# EasyEDA schematic SCH_TempMate_2.json
TITLE: Sheet_1; REV: 1.0; Date: 2025-06-21; Sheet: 1/1; Drawn By: duleni_w; Company: Your Company
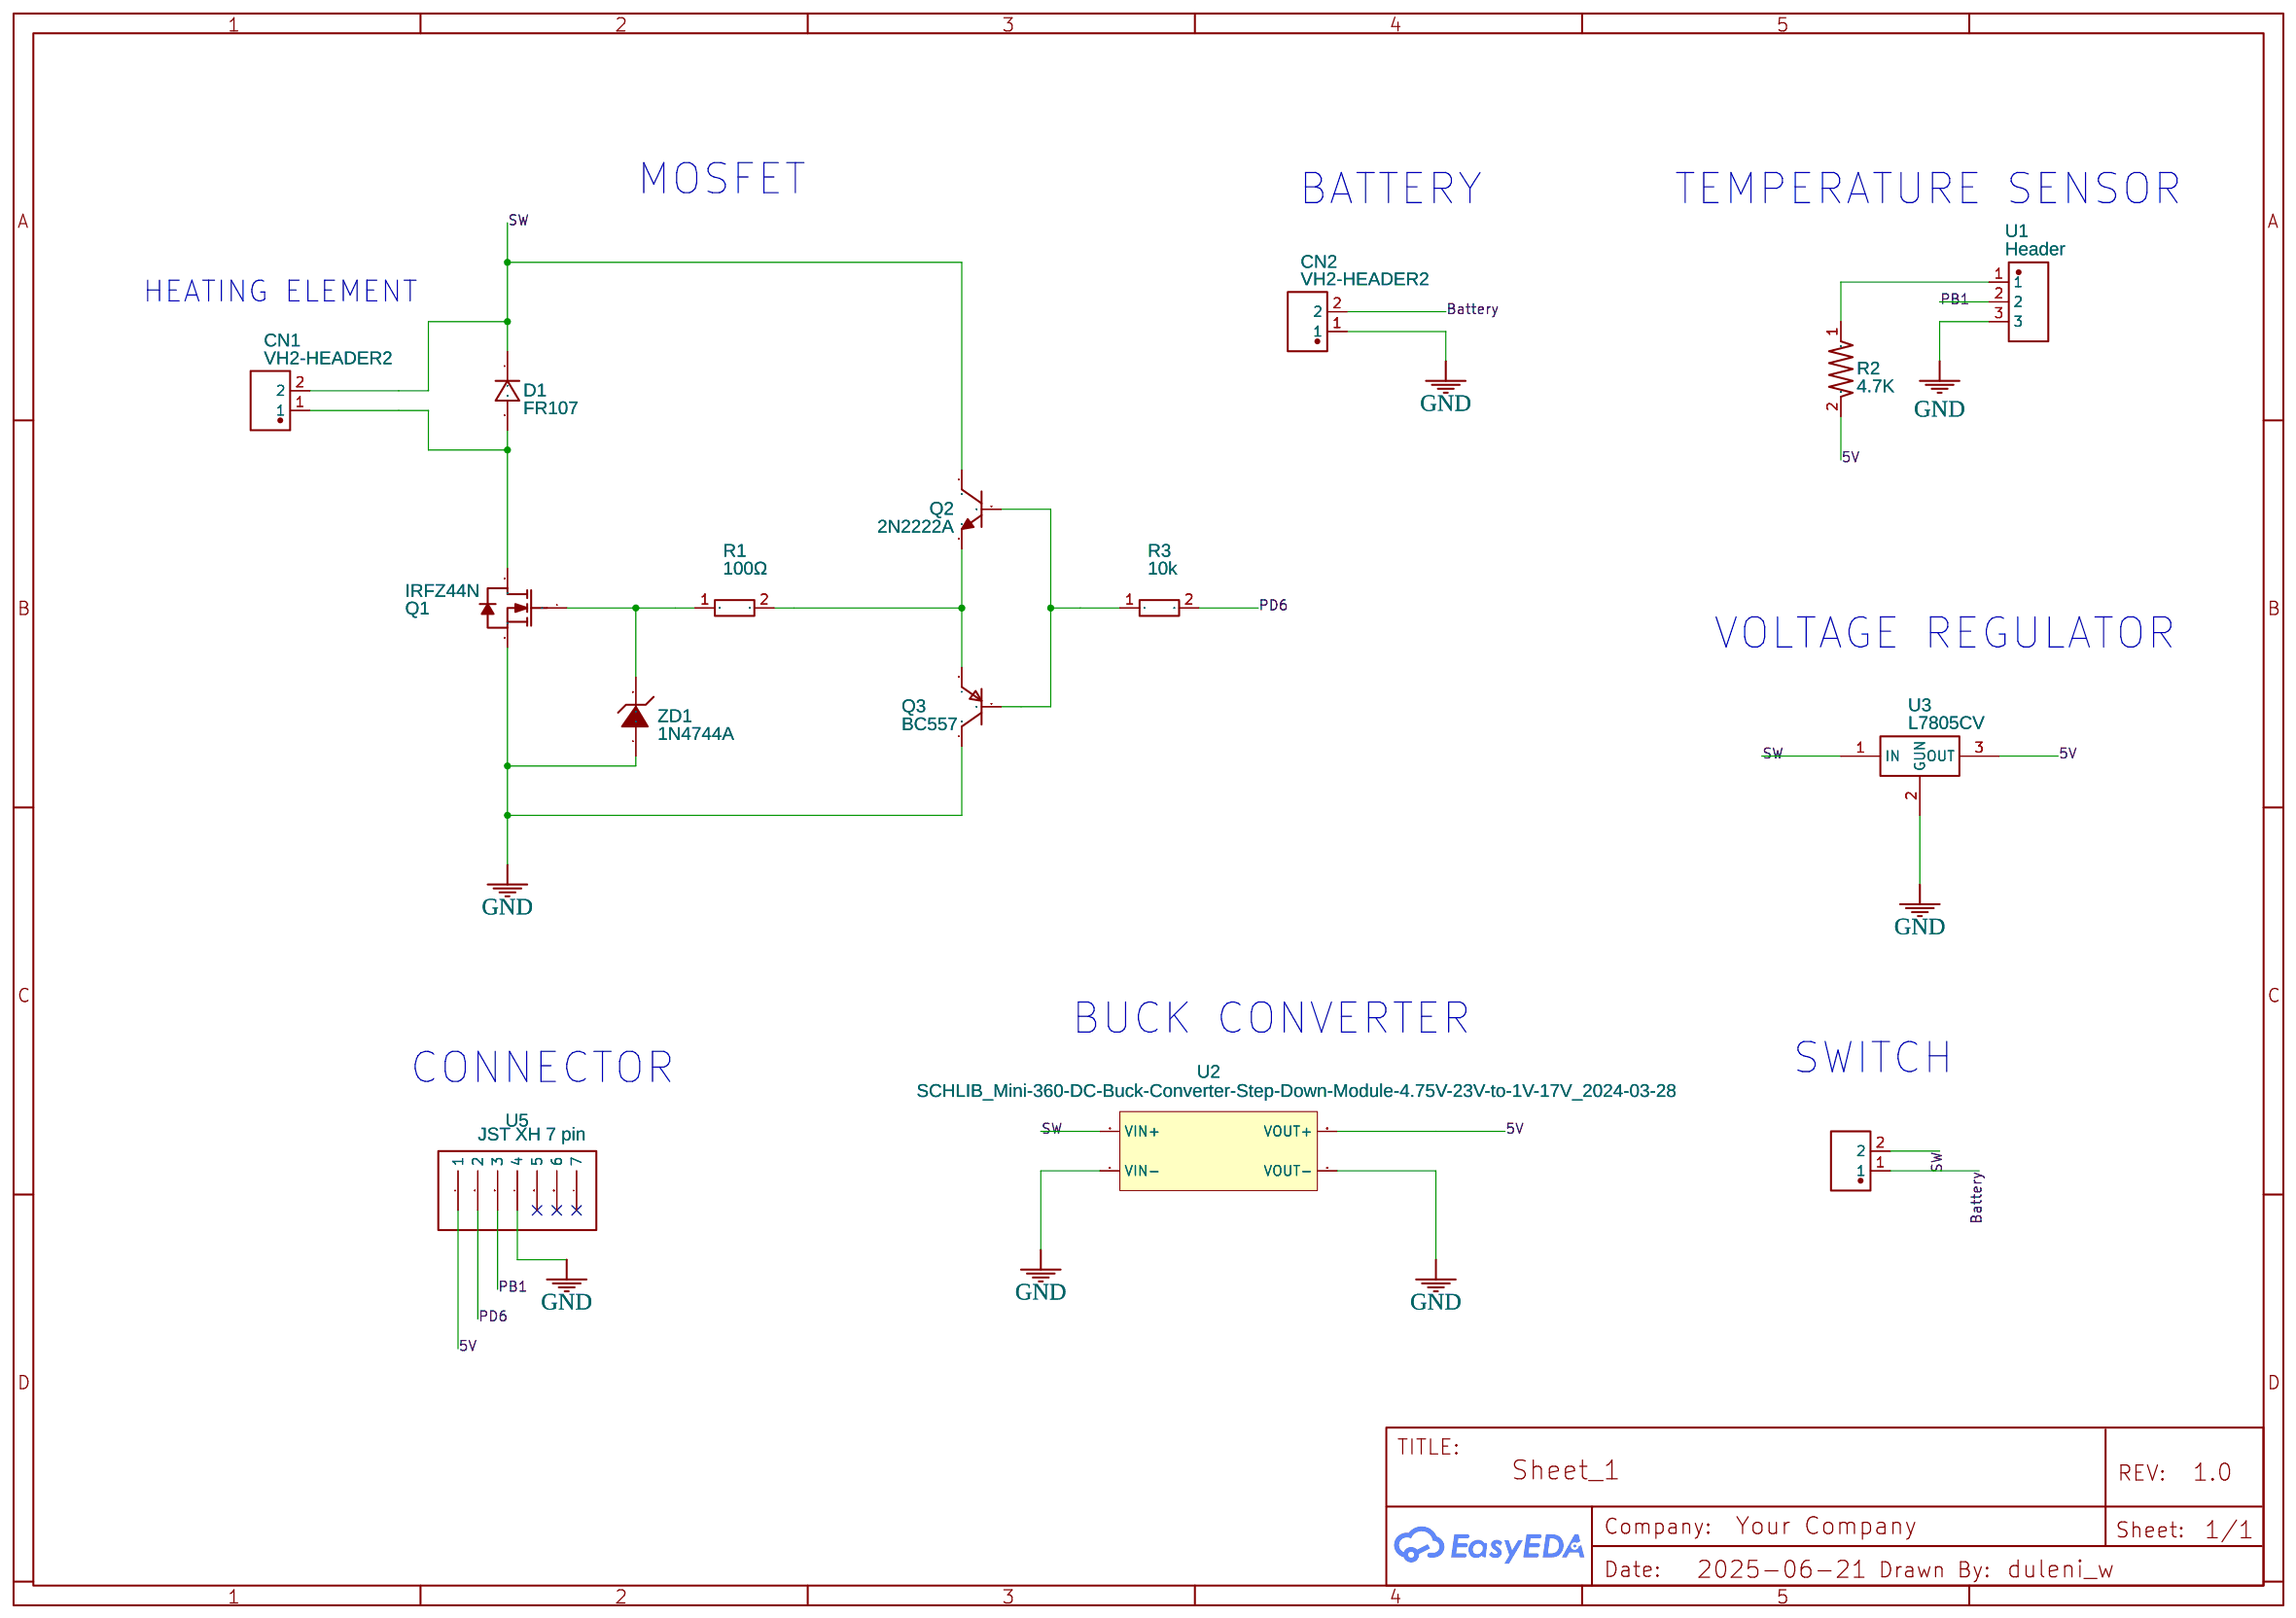
[diagram p0: schematic sheet]

## Parts
CN1  VH2-HEADER2  [CONN-TH_2P-P4.00_VH2-HEADER2]
CN2  VH2-HEADER2  [CONN-TH_2P-P4.00_VH2-HEADER2]
CN3  VH2-HEADER2  [CONN-TH_2P-P4.00_VH2-HEADER2]
D1  FR107  [THROUGH HOLE DIODE]
Q1  IRFZ44N  [TO-220-3_L9.9-W4.5-P2.54-L]
Q2  2N2222A  [TO-92-3_L4.8-W3.7-P2.54-R]
Q3  BC557  [TO-92-3_L4.9-W3.7-P1.27-L]
R1  100Ω  [XOHM-THROUGH-HOLE-RESISTORS-5%-1/4W-D2.3-L6.5MM-FP]
R2  4.7K  [RESISTOR THROUGH-HOLE]
R3  10k  [XOHM-THROUGH-HOLE-RESISTORS-5%-1/4W-D2.3-L6.5MM-FP]
U1  Header  [CONN-TH_3P-P2.54_C9900004449]
U2  SCHLIB_Mini-360-DC-Buck-Converter-Step-Down-Module-4.75V-23V-to-1V-17V_2024-03-28  [MINI 360 DC BUCK CONVERTER STEP DOWN MODULE]
U3  L7805CV  [L7805CV]
U5  JST XH 7 pin  [JST XH 7]
ZD1  1N4744A  [DO-41_BD2.8-L4.2-P8.00-D0.7-FD]

## Library data of the parts
CN1-CN3 = VH2-HEADER2: Contributor: LCSC; Supplier: LCSC; Supplier Part: C9900011009; Manufacturer: null; Manufacturer Part: VH2-Header2; JLCPCB Part Class: Extended Part
D1 = Through Hole Diode: Contributor: baselm
Q1 = IRFZ44N: Contributor: lcsc; Supplier: LCSC; Supplier Part: C7429904; Manufacturer: minos(迈诺斯); JLCPCB Part Class: Extended Part
Q2 = 2N2222A: Contributor: LCSC; Supplier: LCSC; Supplier Part: C358533; Manufacturer: BLUE ROCKET(蓝箭); JLCPCB Part Class: Extended Part
Q3 = BC557: Contributor: LCSC; Supplier Part: C180418; Supplier: LCSC; Manufacturer: CJ(江苏长电/长晶); Manufacturer Part: BC557(RANGE:420-800); JLCPCB Part Class: Extended Part
R1 = XOHM-THROUGH-HOLE-RESISTORS-5%-1/4W-D2.3-L6.5MM: Contributor: LCSC; Supplier: LCSC; Supplier Part: C119313; Manufacturer: CCO(千志电子); Manufacturer Part: MF1/4W-330Ω±1% T; JLCPCB Part Class: Extended Part
R2 = res: Contributor: Saepul Hidayat
R3 = XOHM-THROUGH-HOLE-RESISTORS-5%-1/4W-D2.3-L6.5MM: Contributor: Yousef.Hossam851; Supplier: LCSC; Supplier Part: C119313; Manufacturer: CCO(千志电子); Manufacturer Part: MF1/4W-330Ω±1% T; JLCPCB Part Class: Extended Part
U1 = D21122000060-HEADER3: Contributor: naskarsourav58; Supplier: LCSC; Supplier Part: C9900004449; Manufacturer: null; Manufacturer Part: D21122000060-Header3; JLCPCB Part Class: Extended Part
U2 = SCHLIB_Mini-360-DC-Buck-Converter-Step-Down-Module-4.75V-23V-to-1V-17V_2024-03-28: Contributor: lordfabri
U3 = L7805CV: Contributor: ibrahemhem7
U5 = JST XH 7 pin: Contributor: HenryPenton
ZD1 = 1N4744A: Supplier: LCSC; Manufacturer: ST(先科); Supplier Part: C2547; JLCPCB Part Class: Extended Part

## Nets
5V: R2.2 U2.VOUT+ U3.3(OUT) U5.1
GND: CN2.1 Q1.3(S) Q3.1(C) U1.3 U2.VIN- U2.VOUT- U3.2(GUN) U5.4 ZD1.1(A)
Battery: CN2.2 CN3.1
PB1: U1.2 U5.3
PD6: R3.2 U5.2
SW: CN1.2 CN3.2 D1.1 Q2.1(C) U2.VIN+ U3.1(IN)
Net-(CN1-1): CN1.1 D1.2 Q1.2(D)
Net-(Q1-1): Q1.1(G) R1.1 ZD1.2(K)
Net-(Q2-2): Q2.2(B) Q3.2(B) R3.1
Net-(Q2-3): Q2.3(E) Q3.3(E) R1.2
Net-(R2-1): R2.1 U1.1

Not connected (* = marked no-connect by the designer): U5 5* 6* 7*

## Notes on the sheet
- MOSFET
- BATTERY
- TEMPERATURE SENSOR
- HEATING ELEMENT
- VOLTAGE REGULATOR
- BUCK CONVERTER
- CONNECTOR
- SWITCH
